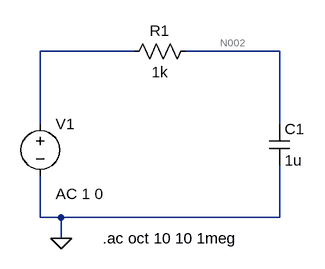
[diagram p0: schematic ac-analysis.asc]
ac-analysis.asc, the LTspice schematic file:
Version 4
SHEET 1 880 680
WIRE 208 48 64 48
WIRE 432 48 288 48
WIRE 64 160 64 48
WIRE 432 160 432 48
WIRE 64 304 64 240
WIRE 96 304 64 304
WIRE 432 304 432 224
WIRE 432 304 96 304
WIRE 96 336 96 304
FLAG 96 336 0
SYMBOL voltage 64 144 R0
WINDOW 123 24 124 Left 2
WINDOW 39 0 0 Left 0
SYMATTR InstName V1
SYMATTR Value ""
SYMATTR Value2 AC 1 0
SYMBOL res 304 32 R90
WINDOW 0 0 56 VBottom 2
WINDOW 3 32 56 VTop 2
SYMATTR InstName R1
SYMATTR Value 1k
SYMBOL cap 416 160 R0
SYMATTR InstName C1
SYMATTR Value 1u
TEXT 160 336 Left 2 !.ac oct 10 10 1meg

The netlist it stands for:
* ac-analysis.asc
V1 N001 0 AC 1 0
R1 N002 N001 1k
C1 N002 0 1u
.ac oct 10 10 1meg
.backanno
.end

* Results of the author's LTspice run, read from the files saved beside the schematic
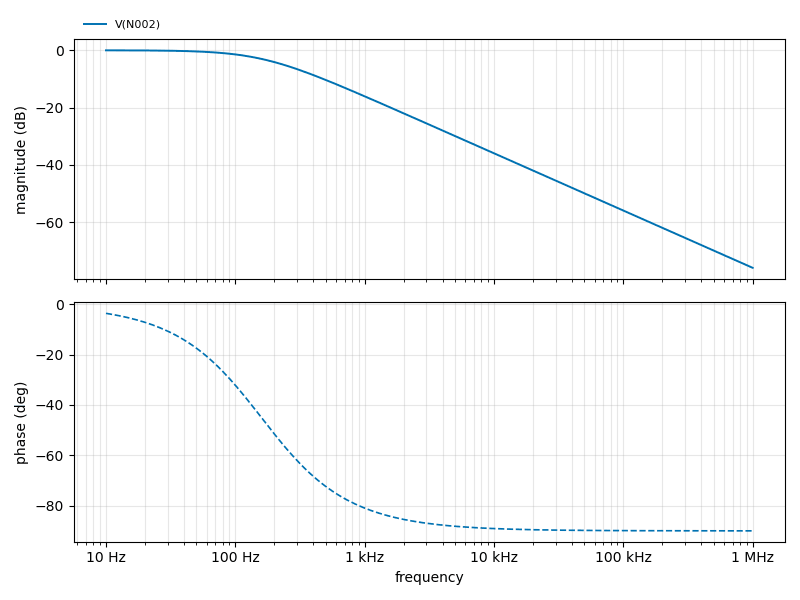
[diagram p1: AC Analysis of ac-analysis.asc, plotted from the saved traces]
* AC Analysis, 1 run:
*   V(N002): -0.02 dB at 10 Hz, -75.96 dB at 1 MHz, peak -0.02 dB at 10 Hz, 3 dB below the peak at 159.8 Hz